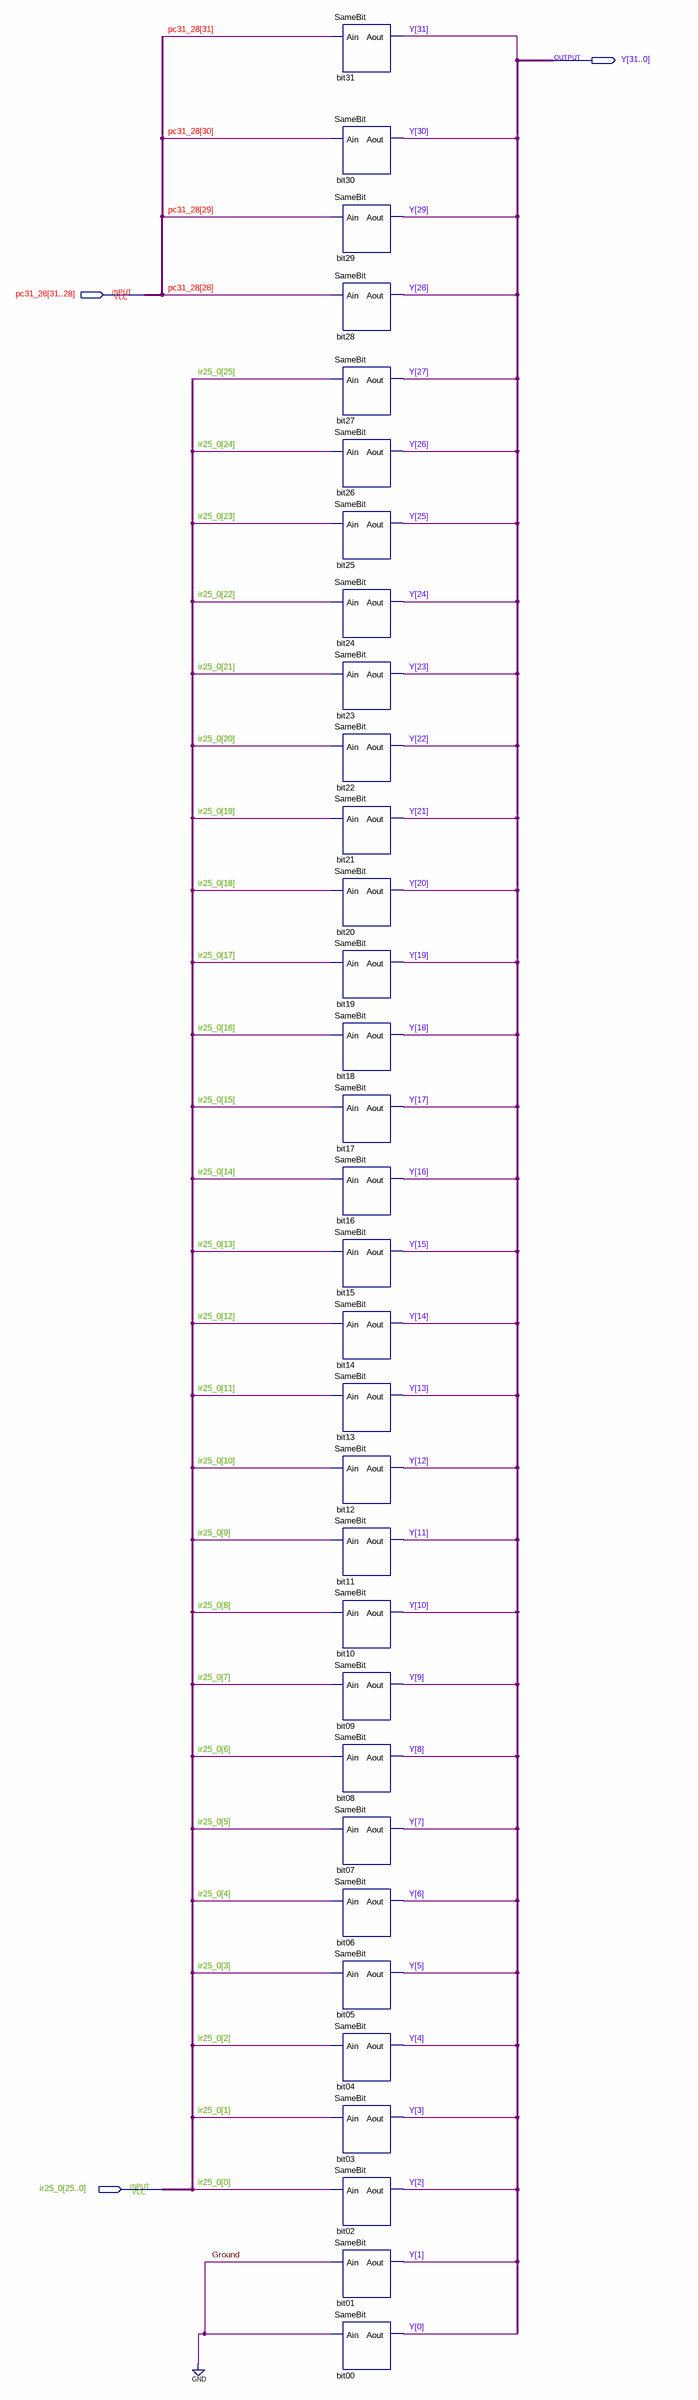
[diagram p0: schematic sheet]
// Quartus schematic SPLICE_PCJ.bdf as structural Verilog: 32 symbols, 3 pins
module SPLICE_PCJ (
  input  [31:28] pc31_28,
  input  [25:0] ir25_0,
  output [31:0] Y
);

  SameBit bit31 (.Ain(pc31_28[31]), .Aout(Y[31]));
  SameBit bit30 (.Ain(pc31_28[30]), .Aout(Y[30]));
  SameBit bit29 (.Ain(pc31_28[29]), .Aout(Y[29]));
  SameBit bit28 (.Ain(pc31_28[28]), .Aout(Y[28]));
  SameBit bit27 (.Ain(ir25_0[25]), .Aout(Y[27]));
  SameBit bit26 (.Ain(ir25_0[24]), .Aout(Y[26]));
  SameBit bit25 (.Ain(ir25_0[23]), .Aout(Y[25]));
  SameBit bit24 (.Ain(ir25_0[22]), .Aout(Y[24]));
  SameBit bit23 (.Ain(ir25_0[21]), .Aout(Y[23]));
  SameBit bit22 (.Ain(ir25_0[20]), .Aout(Y[22]));
  SameBit bit21 (.Ain(ir25_0[19]), .Aout(Y[21]));
  SameBit bit20 (.Ain(ir25_0[18]), .Aout(Y[20]));
  SameBit bit19 (.Ain(ir25_0[17]), .Aout(Y[19]));
  SameBit bit18 (.Ain(ir25_0[16]), .Aout(Y[18]));
  SameBit bit17 (.Ain(ir25_0[15]), .Aout(Y[17]));
  SameBit bit16 (.Ain(ir25_0[14]), .Aout(Y[16]));
  SameBit bit15 (.Ain(ir25_0[13]), .Aout(Y[15]));
  SameBit bit14 (.Ain(ir25_0[12]), .Aout(Y[14]));
  SameBit bit13 (.Ain(ir25_0[11]), .Aout(Y[13]));
  SameBit bit12 (.Ain(ir25_0[10]), .Aout(Y[12]));
  SameBit bit11 (.Ain(ir25_0[9]), .Aout(Y[11]));
  SameBit bit10 (.Ain(ir25_0[8]), .Aout(Y[10]));
  SameBit bit09 (.Ain(ir25_0[7]), .Aout(Y[9]));
  SameBit bit08 (.Ain(ir25_0[6]), .Aout(Y[8]));
  SameBit bit07 (.Ain(ir25_0[5]), .Aout(Y[7]));
  SameBit bit06 (.Ain(ir25_0[4]), .Aout(Y[6]));
  SameBit bit05 (.Ain(ir25_0[3]), .Aout(Y[5]));
  SameBit bit04 (.Ain(ir25_0[2]), .Aout(Y[4]));
  SameBit bit03 (.Ain(ir25_0[1]), .Aout(Y[3]));
  SameBit bit02 (.Ain(ir25_0[0]), .Aout(Y[2]));
  SameBit bit01 (.Ain(1'b0), .Aout(Y[1]));
  SameBit bit00 (.Ain(1'b0), .Aout(Y[0]));
endmodule
